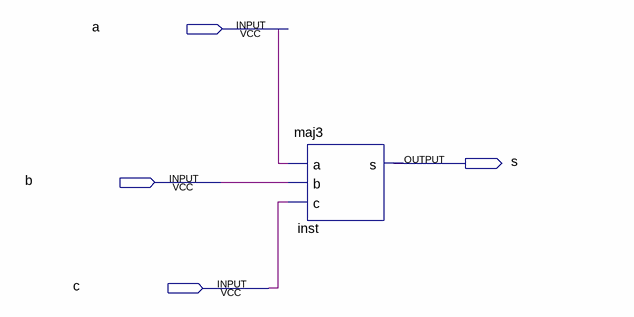
[diagram p0: schematic sheet]
// Quartus schematic mbr_teste_maj.bdf as structural Verilog: 1 symbols, 4 pins
module mbr_teste_maj (
  input  a,
  input  b,
  input  c,
  output s
);

  maj3 inst (.a(a), .b(b), .c(c), .s(s));
endmodule
